# EAGLE design smartstand-usb-dac-i2s-rev-a (EAGLE 7.3.0)

## Sheet 1 of 4
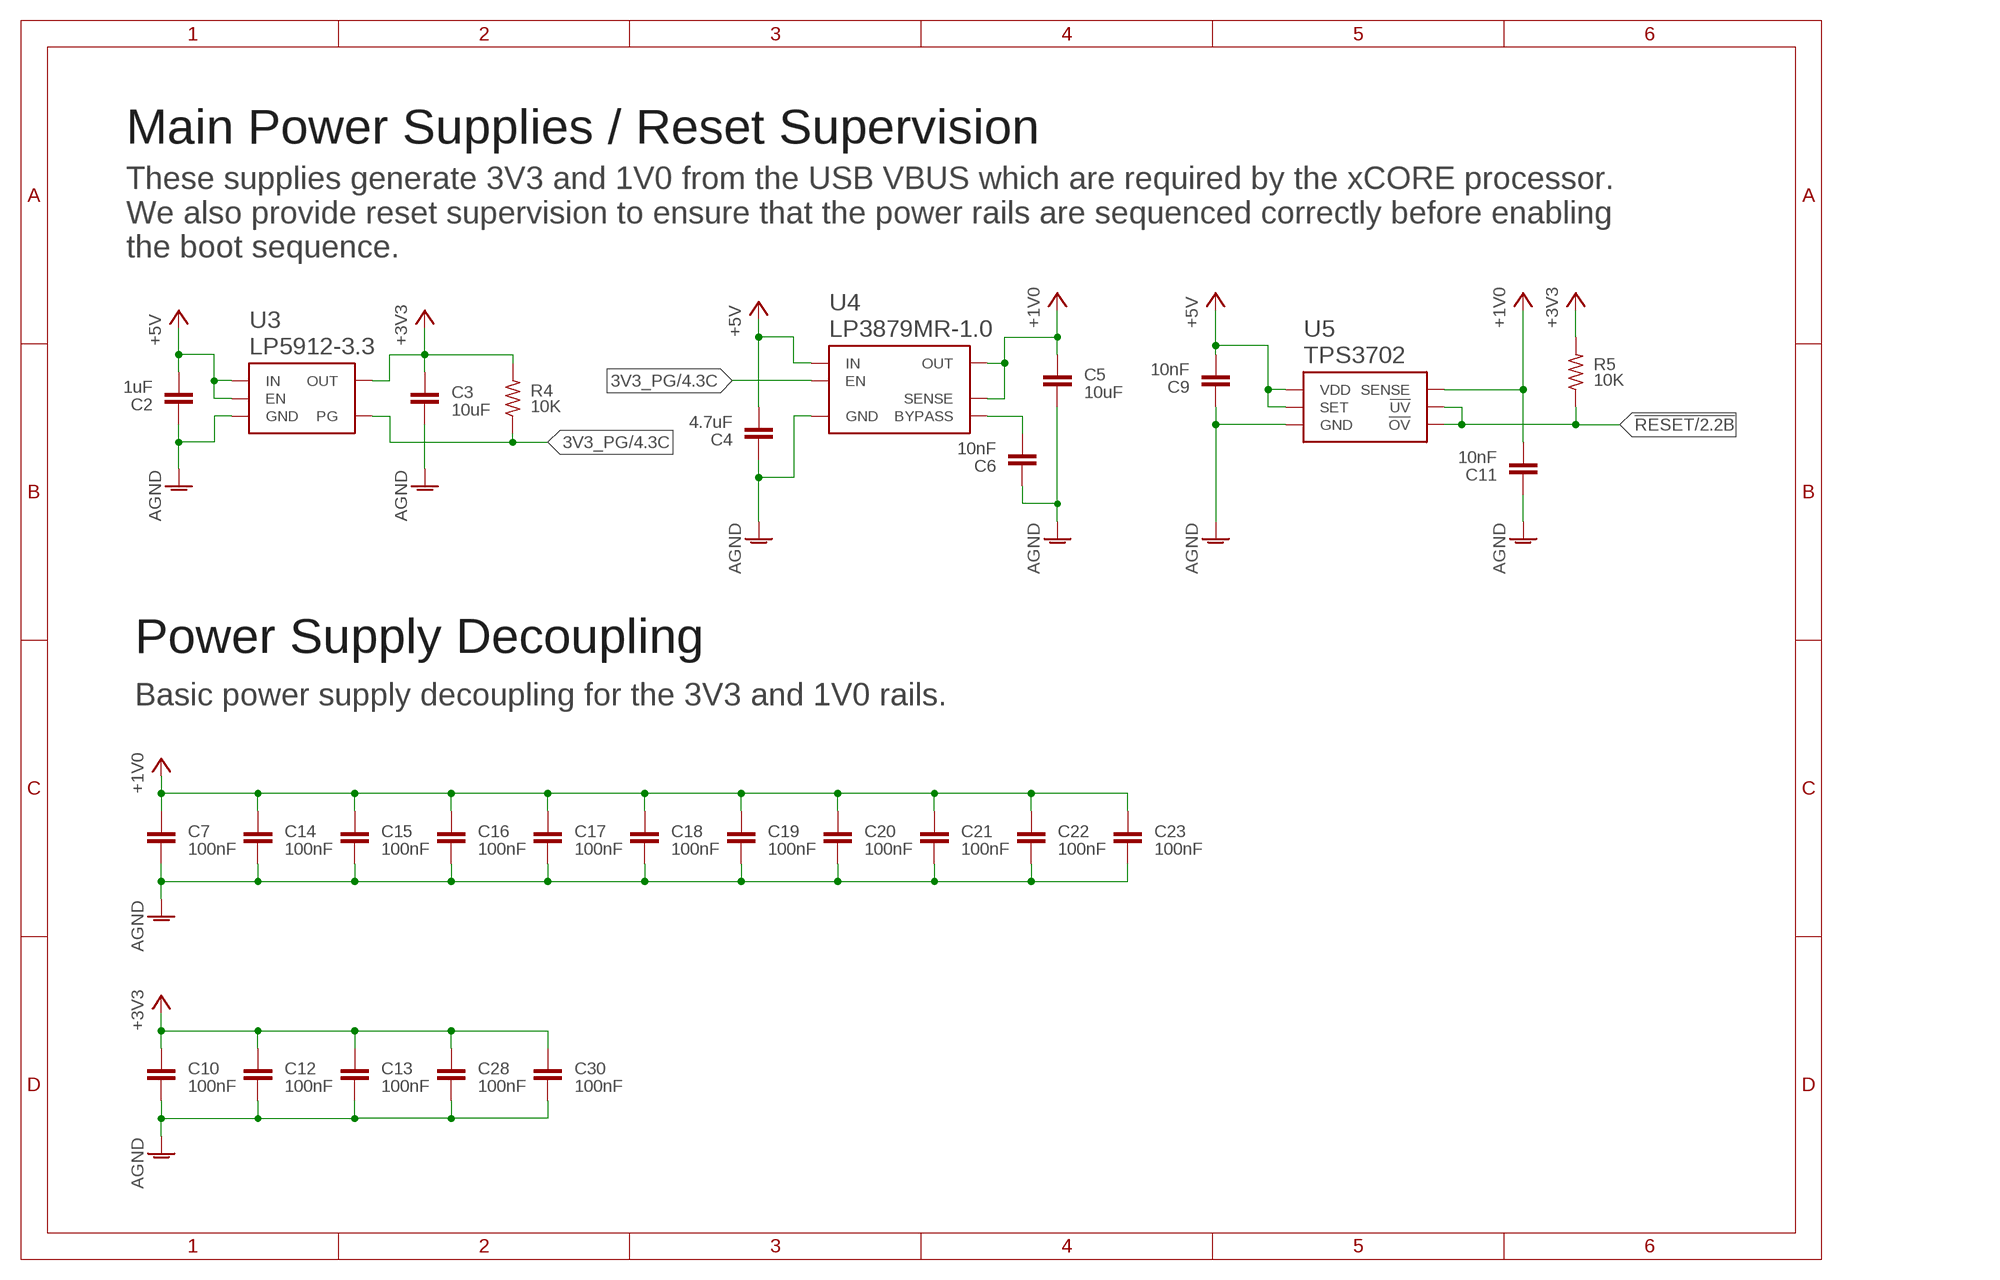
[diagram p0: schematic, sheet 1]

### Parts
C2  1uF  C-EUC0603  [C0603]
C3  10uF  C-EUC0603  [C0603]
C4  4.7uF  C-EUC0603  [C0603]
C5  10uF  C-EUC0603  [C0603]
C6  10nF  C-EUC0402  [C0402]
C7  100nF  C-EUC0402  [C0402]
C9  10nF  C-EUC0402  [C0402]
C10  100nF  C-EUC0402  [C0402]
C11  10nF  C-EUC0402  [C0402]
C12  100nF  C-EUC0402  [C0402]
C13  100nF  C-EUC0402  [C0402]
C14  100nF  C-EUC0402  [C0402]
C15  100nF  C-EUC0402  [C0402]
C16  100nF  C-EUC0402  [C0402]
C17  100nF  C-EUC0402  [C0402]
C18  100nF  C-EUC0402  [C0402]
C19  100nF  C-EUC0402  [C0402]
C20  100nF  C-EUC0402  [C0402]
C21  100nF  C-EUC0402  [C0402]
C22  100nF  C-EUC0402  [C0402]
C23  100nF  C-EUC0402  [C0402]
C28  100nF  C-EUC0402  [C0402]
C30  100nF  C-EUC0402  [C0402]
R4  10K  R-US-VERTICALR0402  [R0402]
R5  10K  R-US-VERTICALR0402  [R0402]
U3  LP5912-3.3  LP5912-3.3DRV  [P-PWSON-N6]
U4  LP3879MR-1.0  [PSOP-8-POWERPAD-DDA]
U5  TPS3702  TPS3702CX10DDC  [R-PDSO-G6]

### Nets
3V3_PG: R4.1 U3.P$3(PG) U4.8(EN) ; also sheet 4
!RESET: R5.1 U5.1(!UV) U5.6(!OV) ; also sheet 2,3
+1V0: C5.1 C7.1 C11.2 C14.1 C15.1 C16.1 C17.1 C18.1 C19.1 C20.1 C21.1 C22.1 C23.1 U4.5(OUT) U4.6(SENSE) U5.3(SENSE) ; also sheet 2,4
+3V3: C3.1 C10.1 C12.1 C13.1 C28.1 C30.1 R4.2 R5.2 U3.P$1(OUT) ; also sheet 2,3,4
+5V: C2.2 C4.2 C9.2 U3.P$4(EN) U3.P$6(IN) U4.4(IN) U5.4(SET) U5.5(VDD) ; also sheet 3,4
AGND: C2.1 C3.2 C4.1 C5.2 C6.1 C7.2 C9.1 C10.2 C11.1 C12.2 C13.2 C14.2 C15.2 C16.2 C17.2 C18.2 C19.2 C20.2 C21.2 C22.2 C23.2 C28.2 C30.2 U3.P$5(GND) U3.P$8(GND) U3.P$9(GND) U3.P$EP(GND) U4.3(GND) U4.EP(GND) U4.P$1(GND) U4.P$2(GND) U4.P$3(GND) U4.P$4(GND) U4.P$5(GND) U4.P$6(GND) U5.2(GND) ; also sheet 2,3,4
N$11: C6.2 U4.1(BYPASS)

### Notes on the sheet
- Main Power Supplies / Reset Supervision
- These supplies generate 3V3 and 1V0 from the USB VBUS which are required by the xCORE processor.
  We also provide reset supervision to ensure that the power rails are sequenced correctly before enabling
  the boot sequence.
- Power Supply Decoupling
- Basic power supply decoupling for the 3V3 and 1V0 rails.

## Sheet 2 of 4
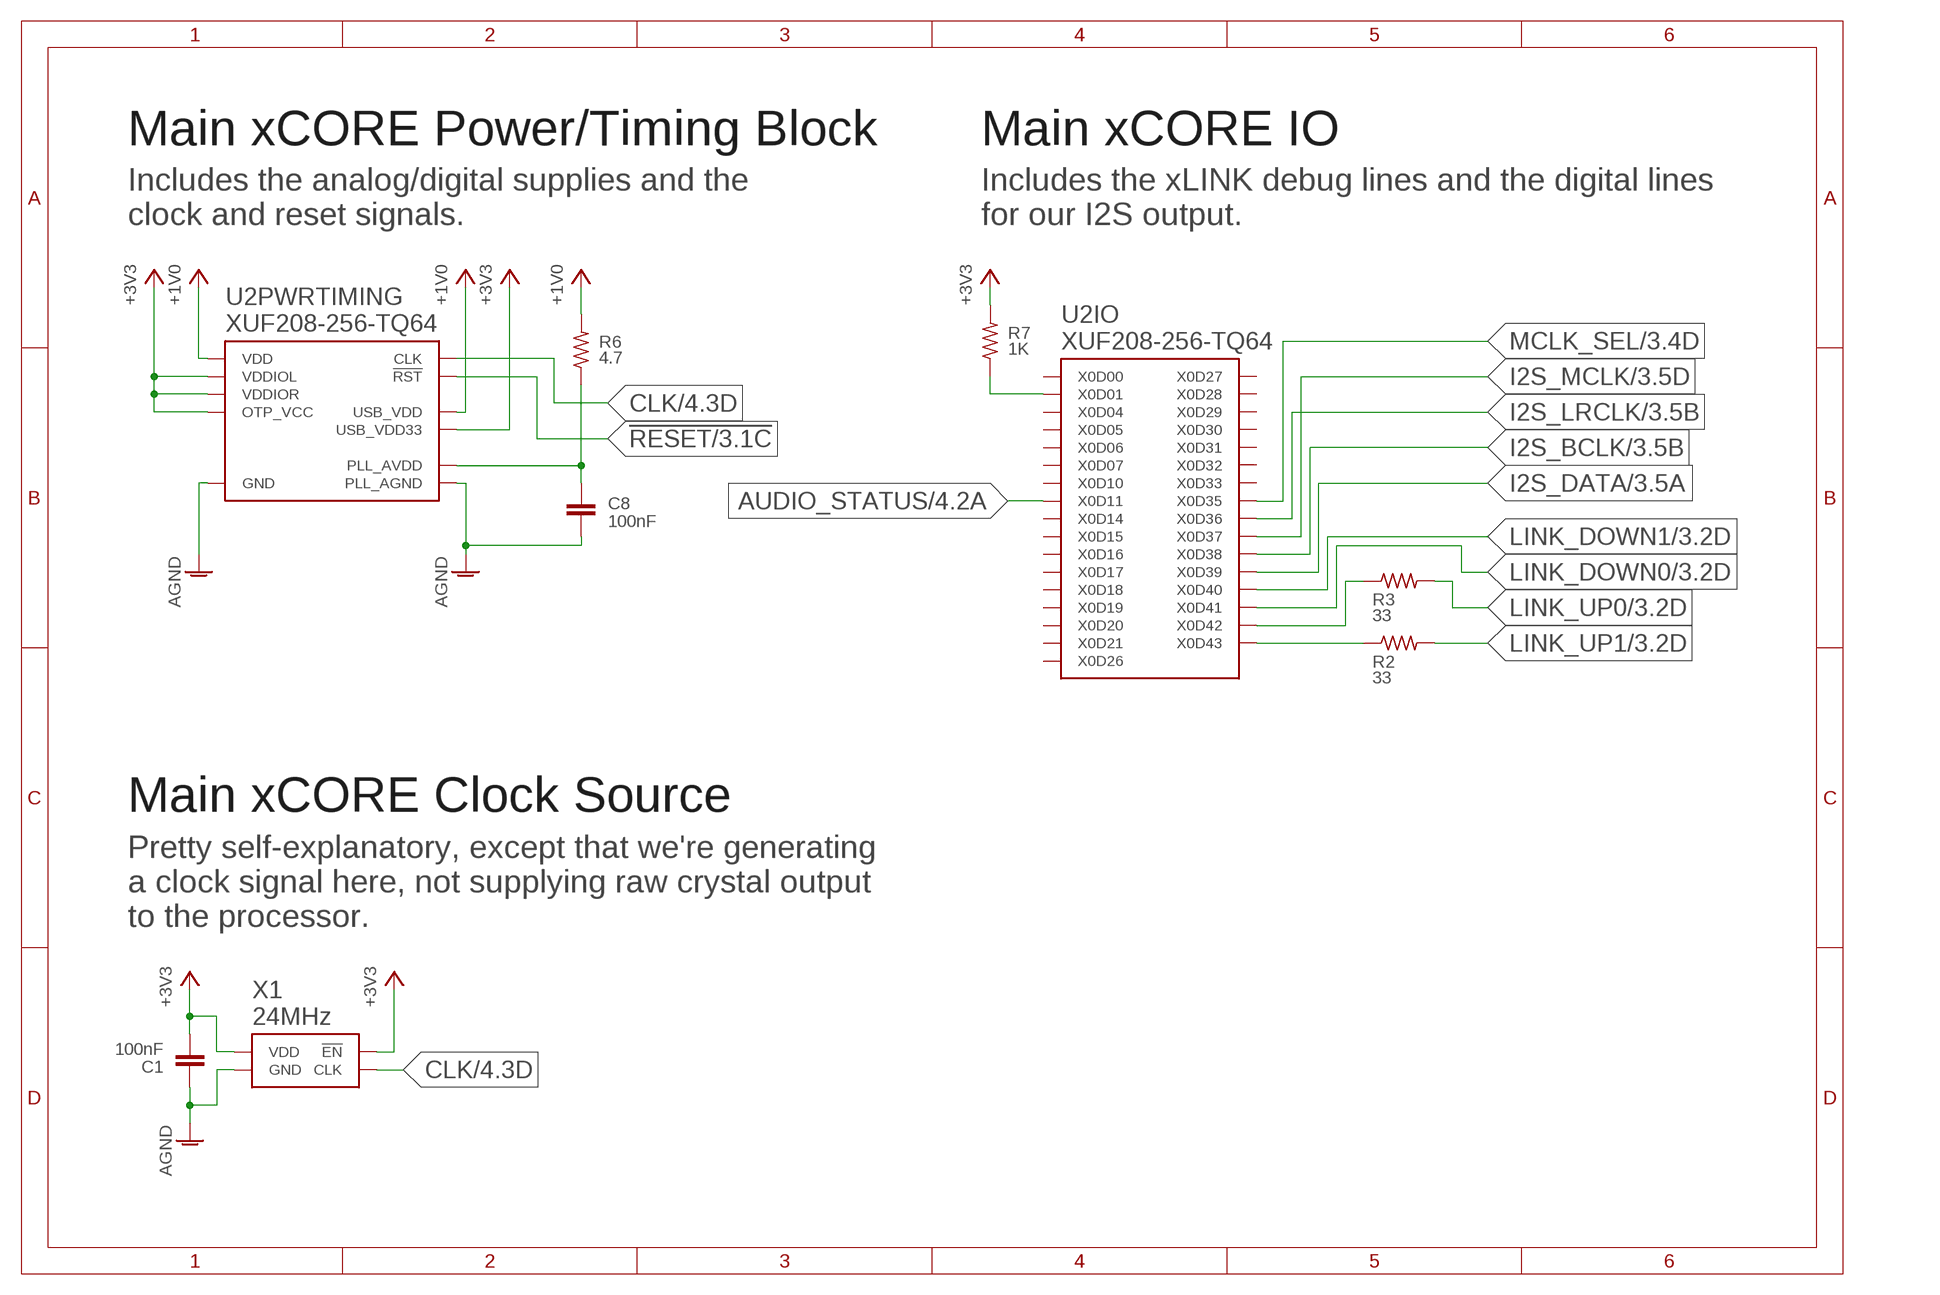
[diagram p1: schematic, sheet 2]

### Parts
C1  100nF  C-EUC0402  [C0402]
C8  100nF  C-EUC0402  [C0402]
R2  33  R-US_R0402  [R0402]
R3  33  R-US_R0402  [R0402]
R6  4.7  R-US-VERTICALR0402  [R0402]
R7  1K  R-US-VERTICALR0402  [R0402]
U2  XUF208-256-TQ64  [TQFP-64-EXPOSED-PAD]
X1  24MHz  KC2520C  [KC2520C]

### Nets
!RESET: U2.P$57(PWRTIMING:!RST) ; also sheet 1,3
+1V0: R6.2 U2.P$9(PWRTIMING:VDD) U2.P$10(PWRTIMING:VDD) U2.P$20(PWRTIMING:VDD) U2.P$27(PWRTIMING:USB_VDD) U2.P$31(PWRTIMING:VDD) U2.P$39(PWRTIMING:VDD) U2.P$40(PWRTIMING:VDD) U2.P$41(PWRTIMING:VDD) U2.P$52(PWRTIMING:VDD) U2.P$56(PWRTIMING:VDD) U2.P$59(PWRTIMING:VDD) ; also sheet 1,4
+3V3: C1.2 R7.2 U2.P$3(PWRTIMING:VDDIOL) U2.P$13(PWRTIMING:VDDIOL) U2.P$22(PWRTIMING:USB_VDD33) U2.P$34(PWRTIMING:VDDIOR) U2.P$44(PWRTIMING:VDDIOR) U2.P$55(PWRTIMING:OTP_VCC) X1.P$1(!EN) X1.P$4(VDD) ; also sheet 1,3,4
AGND: C1.1 C8.2 U2.P$54(PWRTIMING:PLL_AGND) U2.P$65(PWRTIMING:GND) U2.P$66(PWRTIMING:GND) U2.P$67(PWRTIMING:GND) U2.P$68(PWRTIMING:GND) U2.P$69(PWRTIMING:GND) U2.P$70(PWRTIMING:GND) U2.P$71(PWRTIMING:GND) U2.P$72(PWRTIMING:GND) U2.P$73(PWRTIMING:GND) U2.P$74(PWRTIMING:GND) X1.P$2(GND) ; also sheet 1,3,4
AUDIO_STATUS: U2.P$16(IO:X0D11) ; also sheet 4
CLK: U2.P$58(PWRTIMING:CLK) X1.P$3(CLK) ; also sheet 4
I2S_BCLK: U2.P$2(IO:X0D38) ; also sheet 3
I2S_DATA: U2.P$4(IO:X0D39) ; also sheet 3
I2S_LRCLK: U2.P$1(IO:X0D36) ; also sheet 3
I2S_MCLK: U2.P$64(IO:X0D37) ; also sheet 3
LINK_DOWN0: U2.P$6(IO:X0D41) ; also sheet 3
LINK_DOWN1: U2.P$5(IO:X0D40) ; also sheet 3
LINK_UP0: R3.2 ; also sheet 3
LINK_UP1: R2.2 ; also sheet 3
MCLK_SEL: U2.P$42(IO:X0D35) ; also sheet 3
N$6: C8.1 R6.1 U2.P$53(PWRTIMING:PLL_AVDD)
N$8: R3.1 U2.P$7(IO:X0D42)
N$9: R2.1 U2.P$8(IO:X0D43)
N$10: R7.1 U2.P$11(IO:X0D01)
Unconnected: U2.P$12(IO:X0D10) U2.P$14(IO:X0D00) U2.P$15(IO:X0D04) U2.P$17(IO:X0D05) U2.P$18(IO:X0D06) U2.P$19(IO:X0D07) U2.P$28(IO:X0D14) U2.P$29(IO:X0D15) U2.P$30(IO:X0D20) U2.P$32(IO:X0D21) U2.P$35(IO:X0D16) U2.P$36(IO:X0D17) U2.P$37(IO:X0D18) U2.P$38(IO:X0D19) U2.P$43(IO:X0D26) U2.P$45(IO:X0D27) U2.P$46(IO:X0D32) U2.P$47(IO:X0D28) U2.P$48(IO:X0D33) U2.P$49(IO:X0D29) U2.P$50(IO:X0D30) U2.P$51(IO:X0D31)

### Notes on the sheet
- Main xCORE Power/Timing Block | Main xCORE IO
- Includes the analog/digital supplies and the
  clock and reset signals.
- Includes the xLINK debug lines and the digital lines
  for our I2S output.
- Main xCORE Clock Source
- Pretty self-explanatory, except that we're generating
  a clock signal here, not supplying raw crystal output
  to the processor.

## Sheet 3 of 4
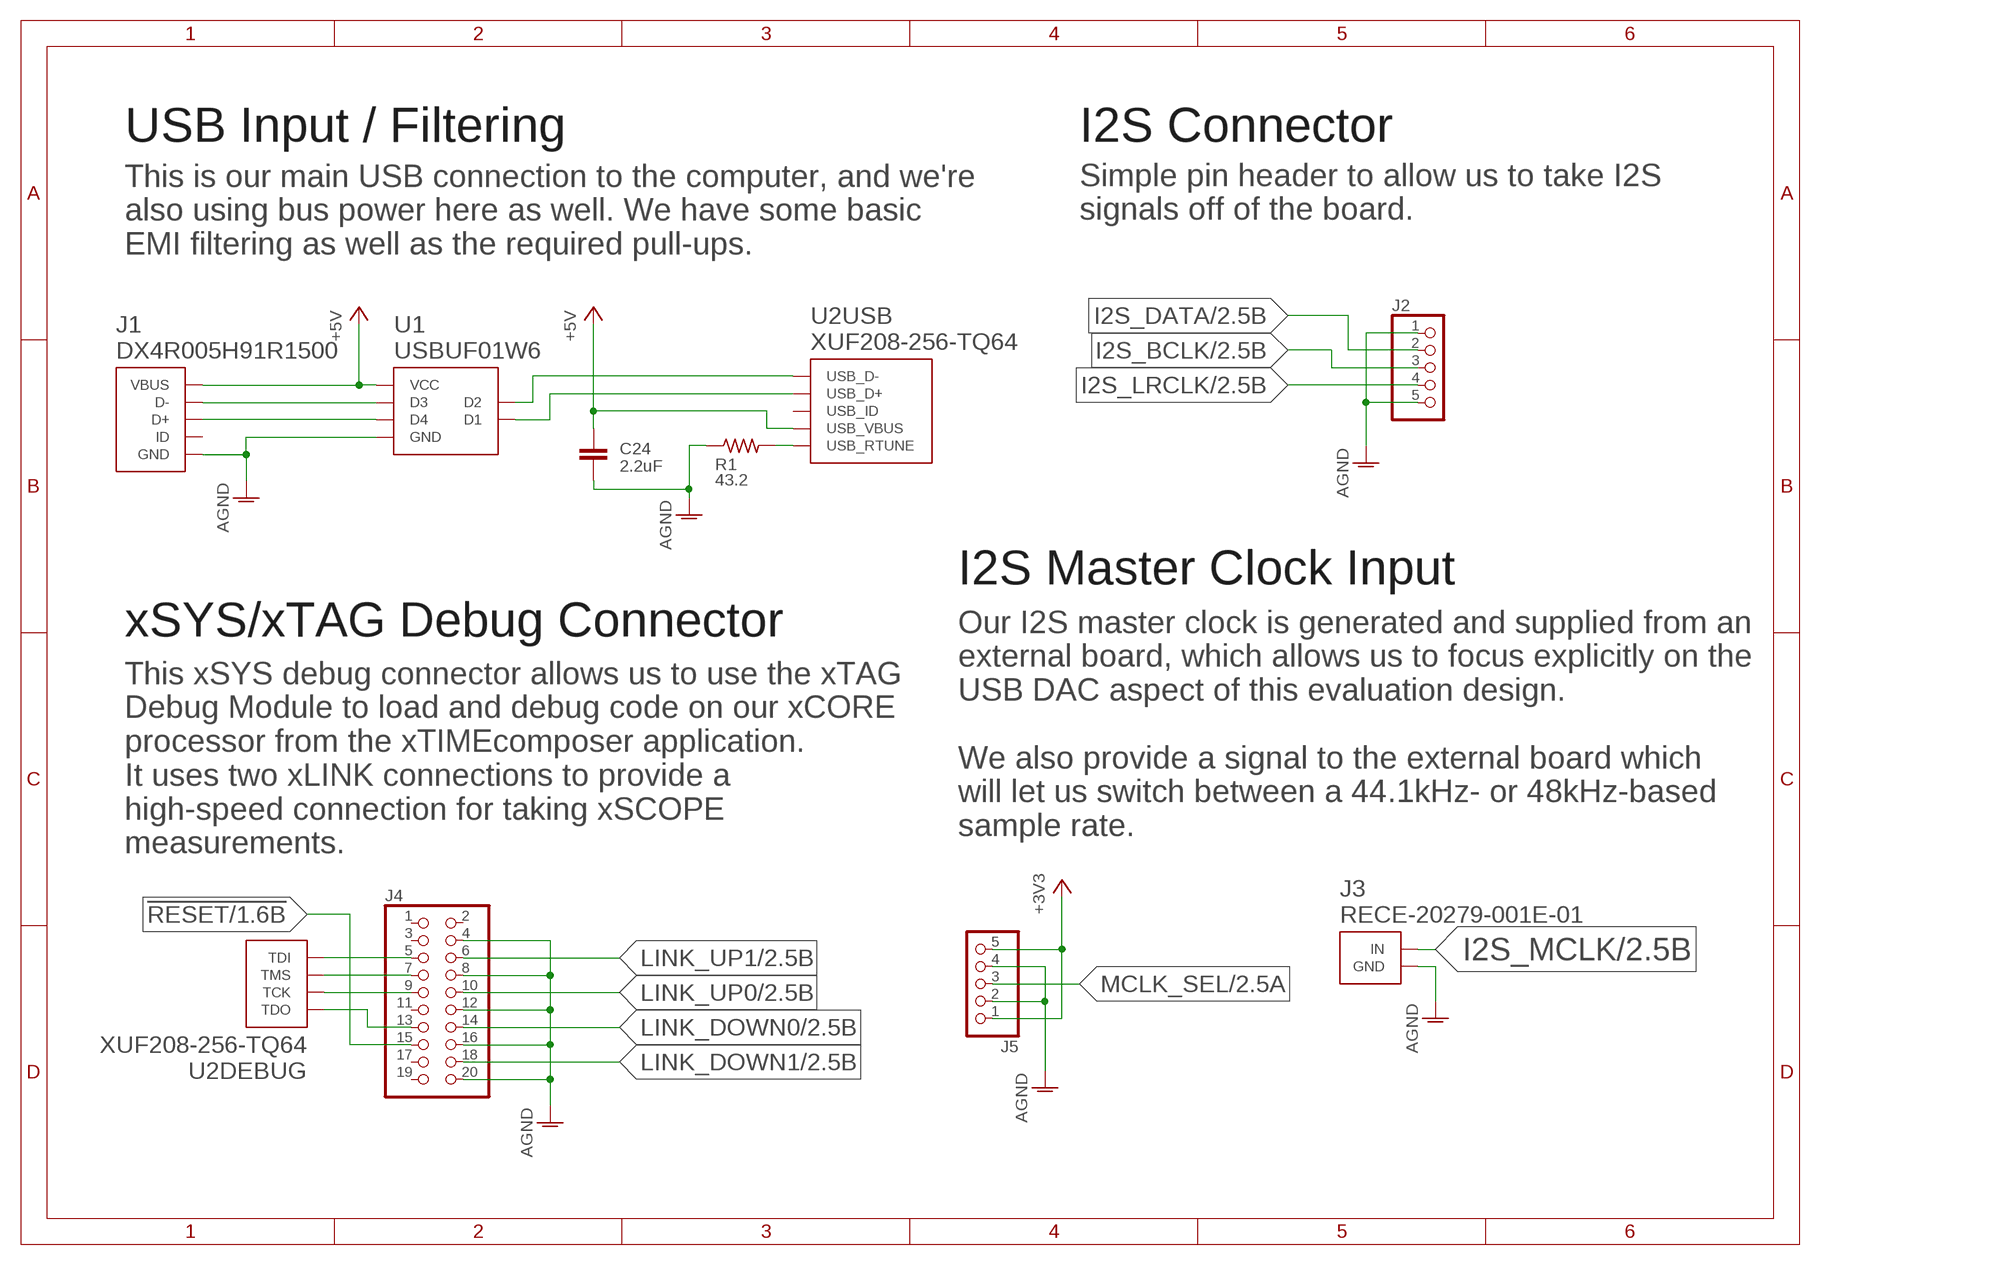
[diagram p2: schematic, sheet 3]

### Parts
C24  2.2uF  C-EUC0603  [C0603]
J1  DX4R005H91R1500  [DX4R005H91R1500]
J2  PINHD-1X5  [1X05]
J3  RECE-20279-001E-01  [IPEX-MHF]
J4  PINHD-2X10  [2X10]
J5  PINHD-1X5  [1X05]
R1  43.2  R-US_R0402  [R0402]
U1  USBUF01W6  USBUF  [SOT323-6L]

### Nets
!RESET: J4.15 ; also sheet 1,2
+3V3: J5.1 J5.5 ; also sheet 1,2,4
+5V: C24.1 J1.P$1(VBUS) U1.P$5(VCC) U2.P$23(USB:USB_VBUS) ; also sheet 1,4
AGND: C24.2 J1.P$5(GND) J2.1 J2.5 J3.P$1(GND) J3.P$2(GND) J4.4 J4.8 J4.12 J4.16 J4.20 J5.2 J5.4 R1.1 U1.P$2(GND) ; also sheet 1,2,4
CLEAN_USB_D_N [USB]: U1.P$3(D2) U2.P$26(USB:USB_D-)
CLEAN_USB_D_P [USB]: U1.P$1(D1) U2.P$25(USB:USB_D+)
I2S_BCLK: J2.3 ; also sheet 2
I2S_DATA: J2.2 ; also sheet 2
I2S_LRCLK: J2.4 ; also sheet 2
I2S_MCLK: J3.P$3(IN) ; also sheet 2
LINK_DOWN0: J4.14 ; also sheet 2
LINK_DOWN1: J4.18 ; also sheet 2
LINK_UP0: J4.10 ; also sheet 2
LINK_UP1: J4.6 ; also sheet 2
MCLK_SEL: J5.3 ; also sheet 2
N$1: R1.2 U2.P$24(USB:USB_RTUNE)
N$2: J4.7 U2.P$60(DEBUG:TMS)
N$3: J4.9 U2.P$61(DEBUG:TCK)
N$4: J4.5 U2.P$62(DEBUG:TDI)
N$5: J4.13 U2.P$63(DEBUG:TDO)
RAW_USB_D_N [USB]: J1.P$2(D-) U1.P$4(D3)
RAW_USB_D_P [USB]: J1.P$3(D+) U1.P$6(D4)
Unconnected: J1.P$4(ID) J4.1 J4.2 J4.3 J4.11 J4.17 J4.19 U2.P$21(USB:USB_ID)

### Notes on the sheet
- USB Input / Filtering | I2S Connector
- Simple pin header to allow us to take I2S
  signals off of the board.
- This is our main USB connection to the computer, and we're
  also using bus power here as well. We have some basic
  EMI filtering as well as the required pull-ups.
- I2S Master Clock Input
- xSYS/xTAG Debug Connector
- Our I2S master clock is generated and supplied from an
  external board, which allows us to focus explicitly on the
  USB DAC aspect of this evaluation design.
  
  We also provide a signal to the external board which
  will let us switch between a 44.1kHz- or 48kHz-based
  sample rate.
- This xSYS debug connector allows us to use the xTAG
  Debug Module to load and debug code on our xCORE
  processor from the xTIMEcomposer application.
  It uses two xLINK connections to provide a
  high-speed connection for taking xSCOPE
  measurements.

## Sheet 4 of 4
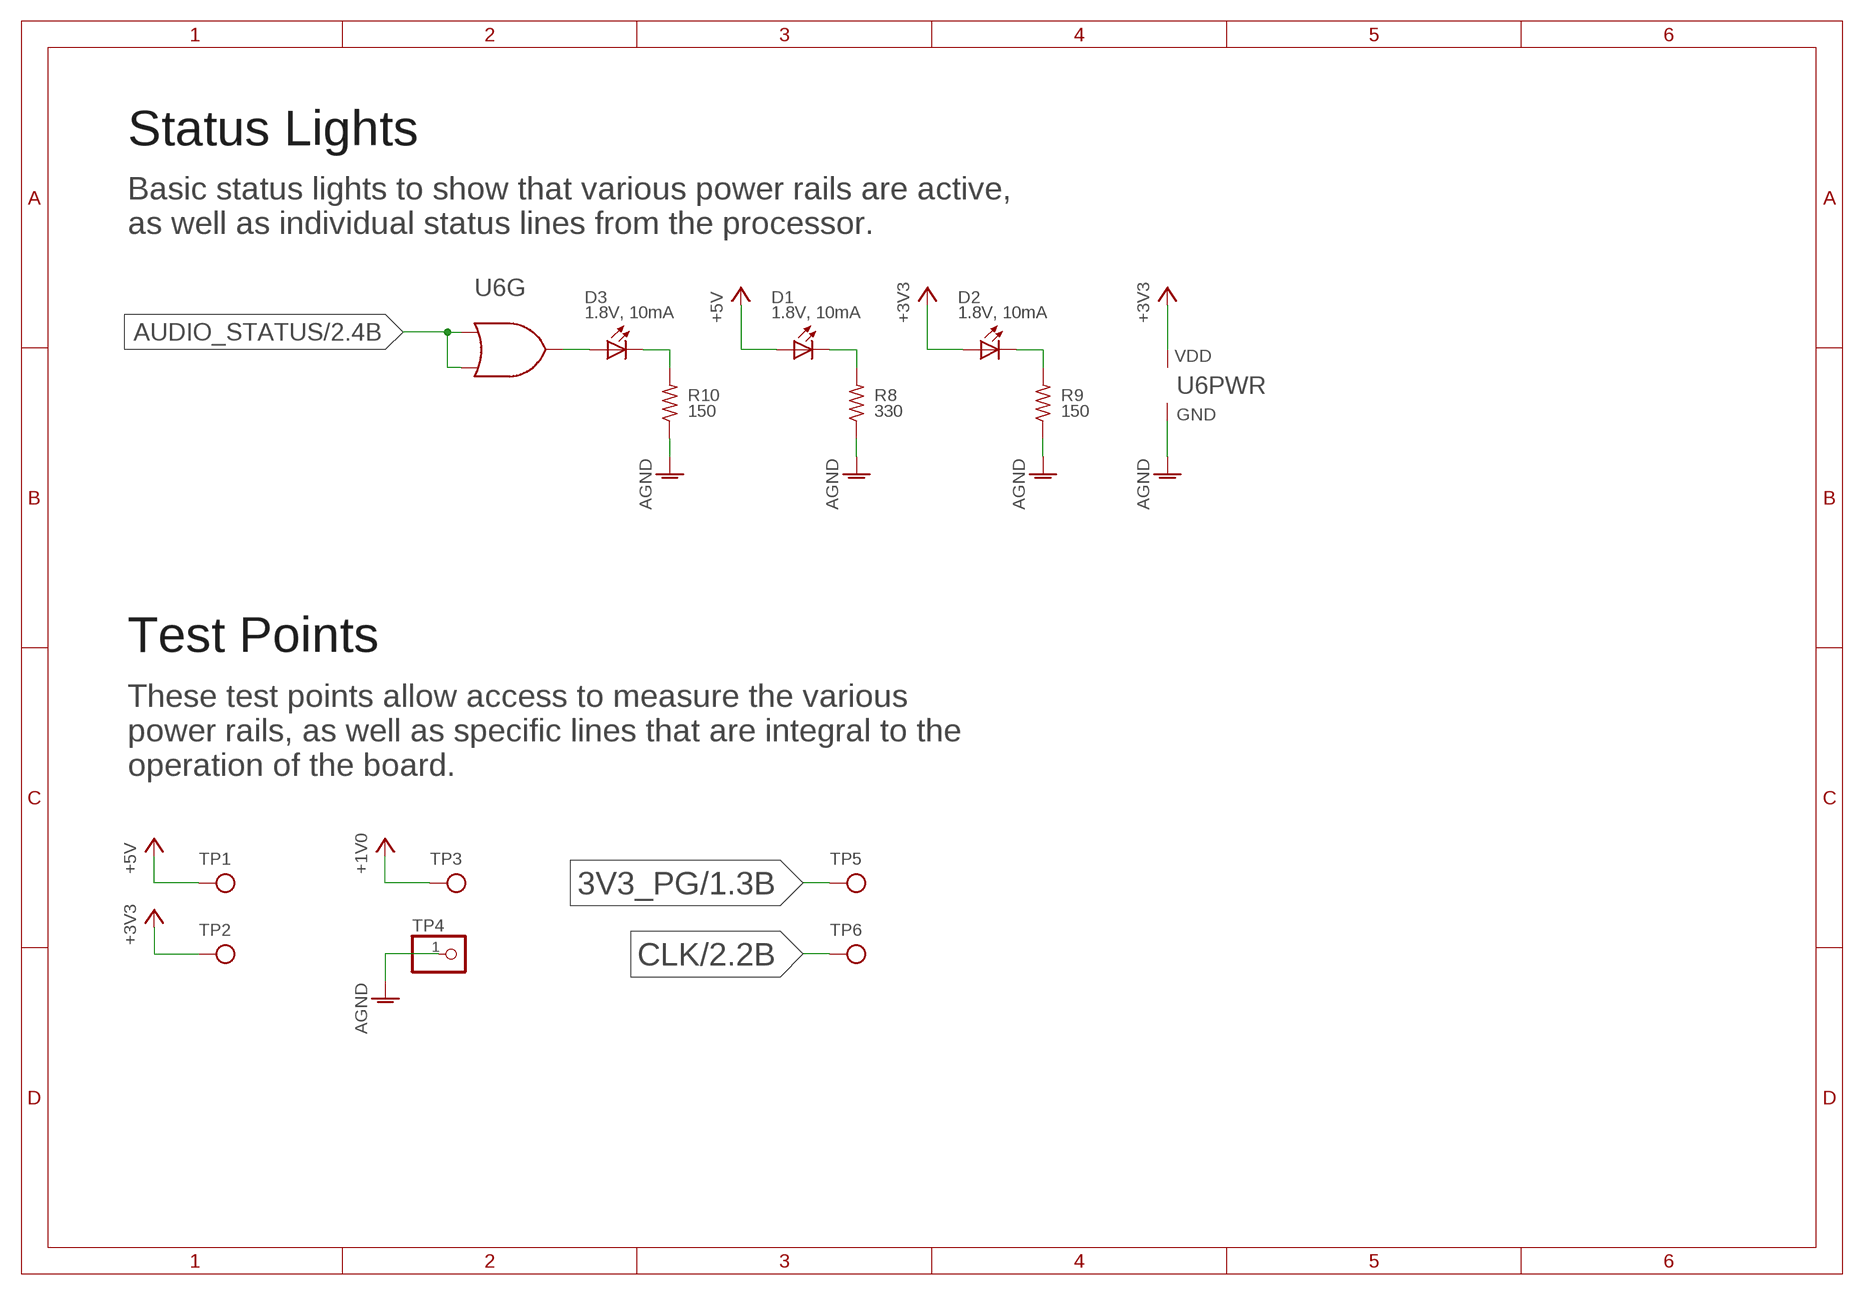
[diagram p3: schematic, sheet 4]

### Parts
D1  1.8V, 10mA  DIALIGHT-598-MICROSMD-0603  [DIALIGHT-0603]
D2  1.8V, 10mA  DIALIGHT-598-MICROSMD-0603  [DIALIGHT-0603]
D3  1.8V, 10mA  DIALIGHT-598-MICROSMD-0603  [DIALIGHT-0603]
R8  330  R-US-VERTICALR0402  [R0402]
R9  150  R-US-VERTICALR0402  [R0402]
R10  150  R-US-VERTICALR0402  [R0402]
TP1  TESTPOINT-1.5MM  [TESTPOINT-1.5]
TP2  TESTPOINT-1.5MM  [TESTPOINT-1.5]
TP3  TESTPOINT-1.5MM  [TESTPOINT-1.5]
TP4  PINHD-1X1  [1X01]
TP5  TESTPOINT-1.5MM  [TESTPOINT-1.5]
TP6  TESTPOINT-1.5MM  [TESTPOINT-1.5]
U6  SN74LVC1G32DRL  [R-PDSO-N5]

### Nets
3V3_PG: TP5.P$1 ; also sheet 1
+1V0: TP3.P$1 ; also sheet 1,2
+3V3: D2.1(A) TP2.P$1 U6.5(PWR:VDD) ; also sheet 1,2,3
+5V: D1.1(A) TP1.P$1 ; also sheet 1,3
AGND: R8.1 R9.1 R10.1 TP4.1 U6.3(PWR:GND) ; also sheet 1,2,3
AUDIO_STATUS: U6.1(G:A) U6.2(G:B) ; also sheet 2
CLK: TP6.P$1 ; also sheet 2
N$7: D1.2(C) R8.2
N$12: D2.2(C) R9.2
N$13: D3.1(A) U6.4(G:Q)
N$14: D3.2(C) R10.2

### Notes on the sheet
- Status Lights
- Basic status lights to show that various power rails are active,
  as well as individual status lines from the processor.
- Test Points
- These test points allow access to measure the various
  power rails, as well as specific lines that are integral to the
  operation of the board.

## Library data of the parts
C1 C7 C8 C10 C12-C23 C28 C30 = passives:C-EU: CAPACITOR, European symbol; PN: GRM155R71C104KA88D
C2 = passives:C-EU: CAPACITOR, European symbol; PN: GRM188R61C105KA93D
C3 C5 = passives:C-EU: CAPACITOR, European symbol; PN: GRM188R60J106ME47D
C4 = passives:C-EU: CAPACITOR, European symbol; PN: GRM188R61A475KE15D
C6 C9 C11 = passives:C-EU: CAPACITOR, European symbol; PN: GRM15XR71C103KA86D
C24 = passives:C-EU: CAPACITOR, European symbol; PN: GRM188R61C225KE15D
D1-D3 = dialight:DIALIGHT-598-MICROSMD; PN: 598-8070-107F
J1 = jae:DX4R005H91R1500; PN: DX4R005H91R1500
J2 J5 = pin-headers:PINHD-1X5: PIN HEADER; PN: 90120-0125
J3 = taoglas:RECE-20279-001E-01; PN: RECE-20279-001E-01
J4 = pin-headers:PINHD-2X10: PIN HEADER; PN: N2520-5002RB
R1 = passives:R-US_: RESISTOR, American symbol; PN: RK73B1ETTP430J
R2 R3 = passives:R-US_: RESISTOR, American symbol; PN: RK73B1ETTP330J
R4 R5 = passives:R-US-VERTICAL; PN: RK73B1ETTP103J
R6 = passives:R-US-VERTICAL; PN: SG73P1ETTP4R7J
R7 = passives:R-US-VERTICAL; PN: RK73B1ETTP102J
R8 = passives:R-US-VERTICAL; PN: ERJ-PA2J331X
R9 R10 = passives:R-US-VERTICAL; PN: SG73P1ETTP151J
TP1-TP3 TP5 TP6 = test:TESTPOINT: Simple exposed copper testpoint pad.
TP4 = pin-headers:PINHD-1X1: PIN HEADER; PN: 90120-0121
U1 = st-microelectronics:USBUF: EMI filter and line termination for USB upstream ports The USB specification requires upstream ports to be terminated with pull-up resistors from the D+ and D- lines to Vbus. On the implementation of USB systems, the radiated and conducted EMI should be kept within the required levels as stated by the FCC regulations. In addition to the requirements of termination and EMC compatibility, the computing devices are required to be tested for ESD susceptibility. The USBUF provides the recommended line termination while implementing a low pass filter to limit EMI levels and providing ESD protection which exceeds IEC 61000-4-2 level 4 standard. The device is packaged in a SOT323-6L which is the smallest available lead frame package (50% smaller than the standard SOT23).; PN: USBUF01W6
U2 = xmos:XUF208-256-TQ64: Multicore Microcontroller with Advanced Multi-Core RISC Architecture https://www.xmos.com/download/private/XUF208-256-TQ64-Datasheet%281.10%29.pdf; PN: XUF208-256-TQ64-C10
U3 = texas-instruments:LP5912: 500-mA Low-Noise, Low-IQ LDO; PN: LP5912-3.3DRVR
U4 = texas-instruments:LP3879: LP3879 - Micropower 800mA Low Noise "Ceramic Stable" Voltage Regulator for Low Voltage Applications The LP3879 is a 800 mA fixed-output voltage regulator designed to provide high performance and low noise in applications requiring output voltages between 1.0V and 1.2V. Using an optimized VIP (Vertically Integrated PNP) process, the LP3879 delivers superior performance: Ground Pin Current: Typically 5.5 mA @ 800 mA load, and 200 µA @ 100 µA load. Low Power Shutdown: The LP3879 draws less than 10 μA quiescent current when shutdown pin is pulled low. Precision Output: Ensured output voltage accuracy is 1% at room temperature. Low Noise: Broadband output noise is only 18 μV (typical) with 10 nF bypass capacitor.; PN: LP3879MR-1.0/NOPB
U5 = texas-instruments:TPS3702: High-Accuracy, Overvoltage and Undervoltage Monitor; PN: TPS3702CX10DDC
U6 = texas-instruments:SN74LVC1G32: Single 2-Input Positive-OR Gate This single 2-input positive-OR gate is designed for 1.65-V to 5.5-V VCC operation. The SN74LVC1G32 performs the Boolean function Y = A + B in positive logic. NanoStar™ and NanoFree™ package technology is a major breakthrough in IC packaging concepts, using the die as the package. This device is fully specified for partial-power-down applications using Ioff. The Ioff circuitry disables the outputs, preventing damaging current backflow through the device when it is powered down.; PN: SN74LVC1G32DRLR
X1 = crystals:KC2520C: High Stability Clock Oscillators, CMOS, 2.5V/3.3V Compatible, 2.5×2.0mm; PN: KC2520C24.0000C2LE00

## Net classes
0 default: width 0.152 mm, drill 0.254 mm
1 USB: width 0.279 mm, drill 0.254 mm, clearance 0.203 mm

## Board
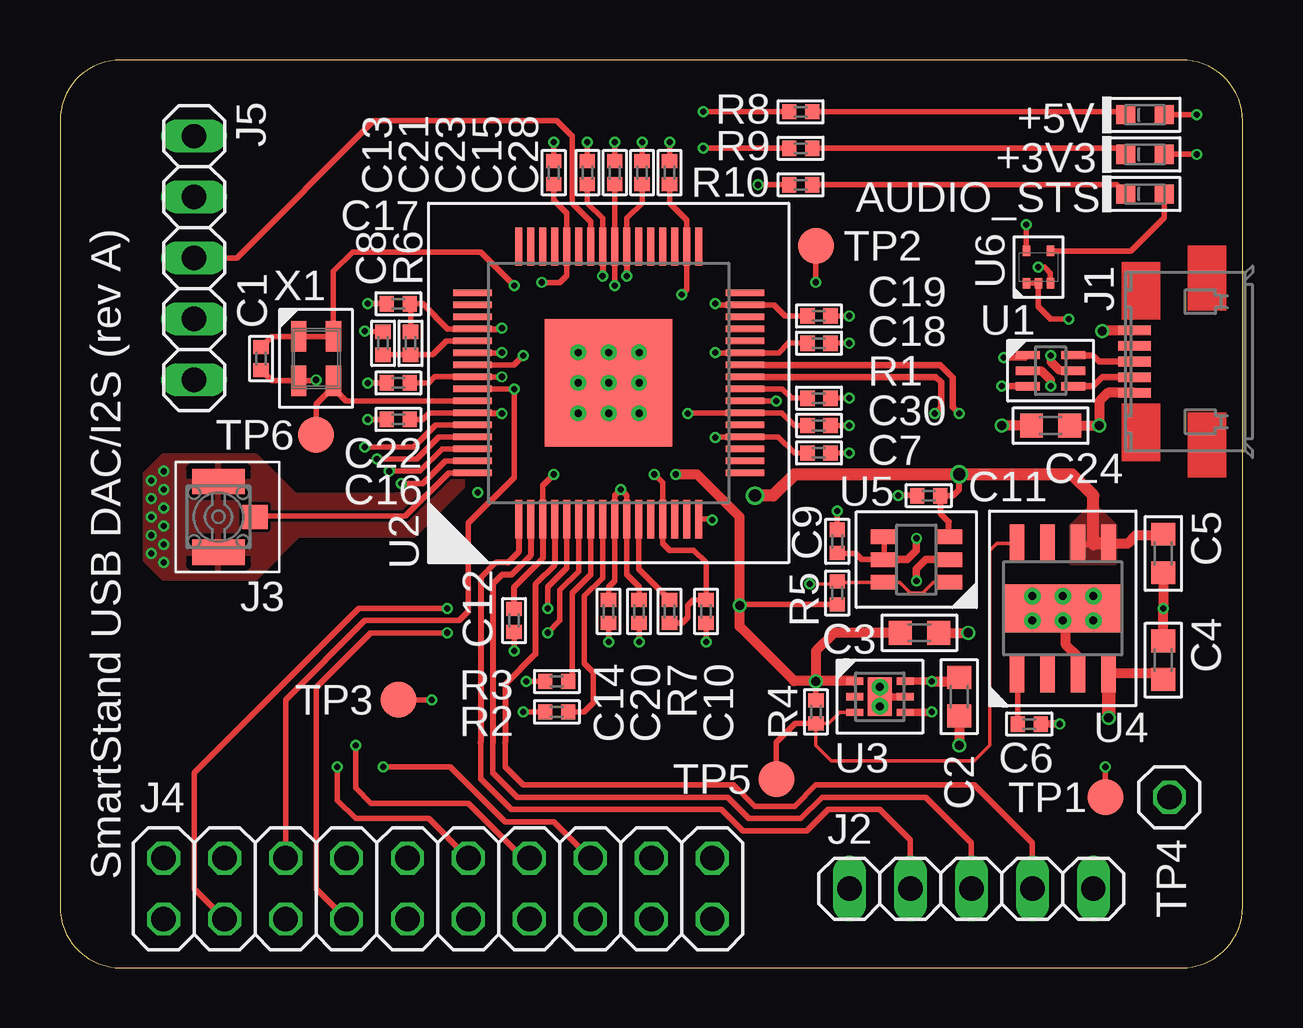
[diagram p4: board, top side]
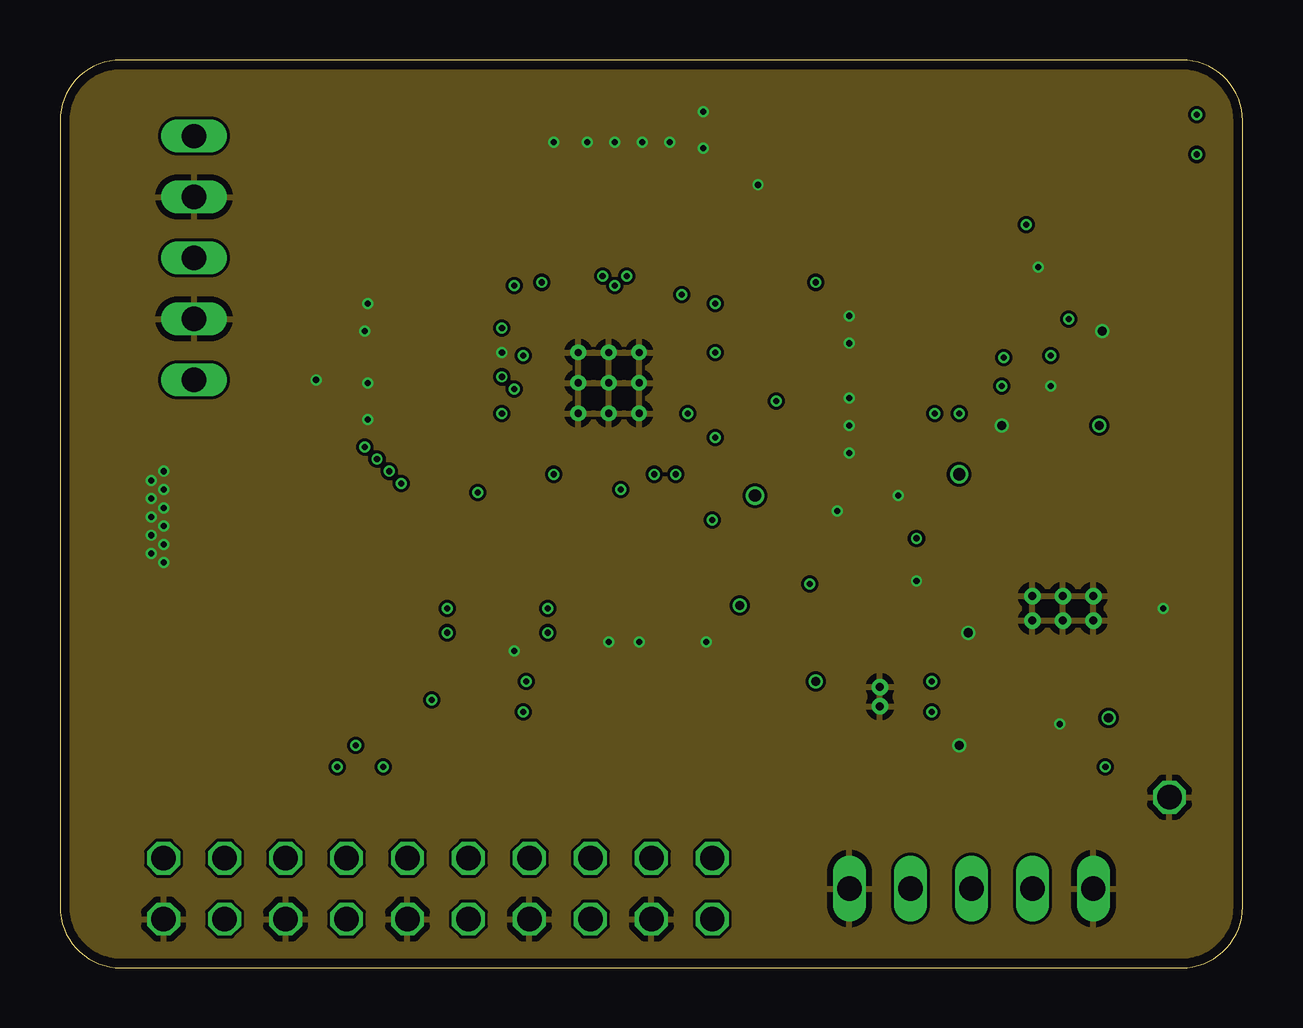
[diagram p5: board, inner layer Route2]
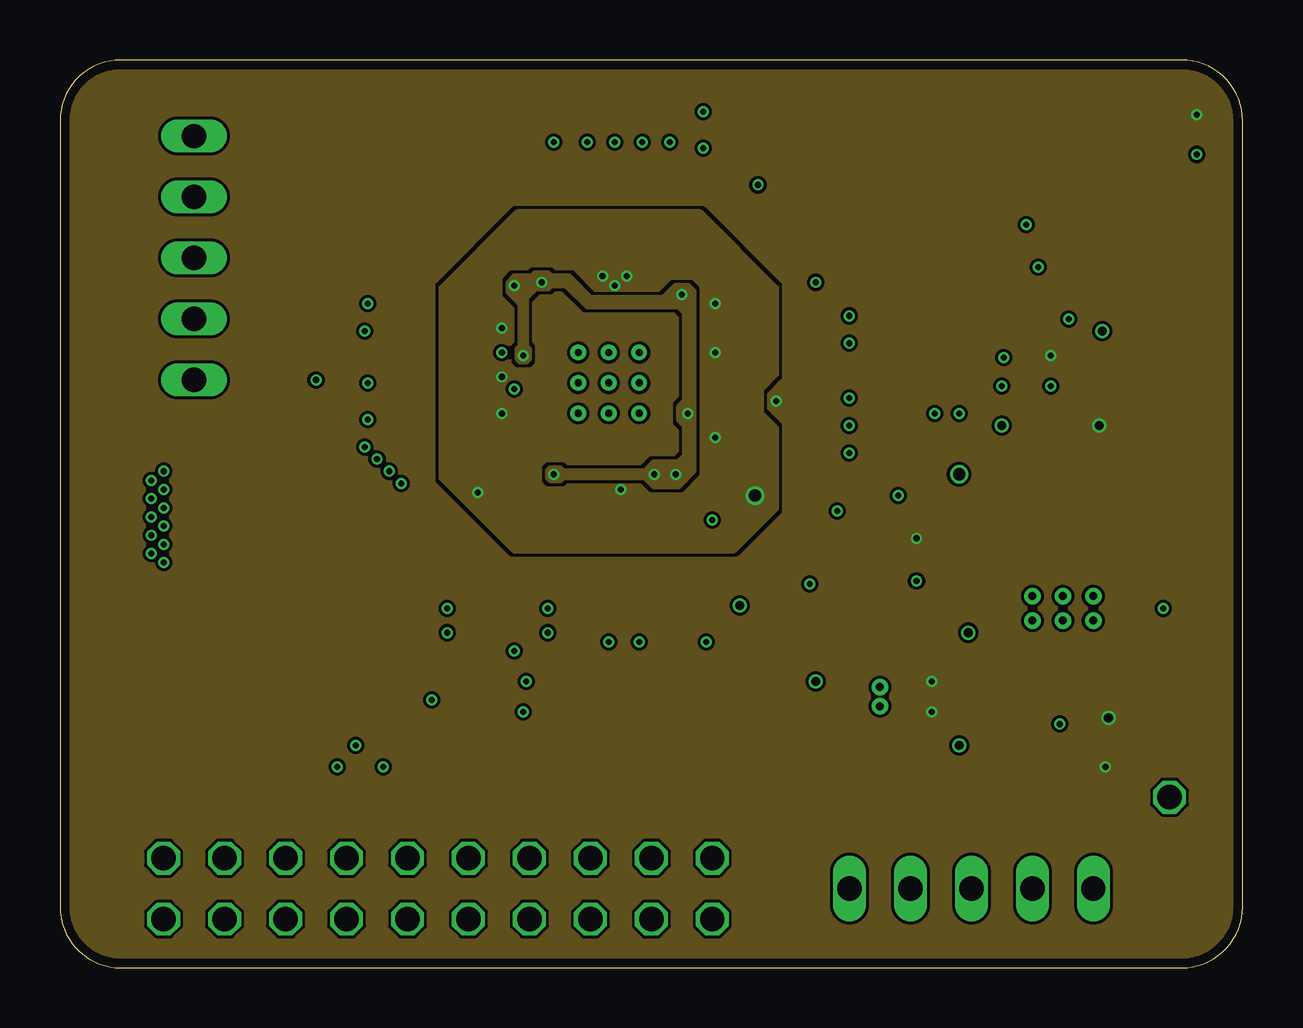
[diagram p6: board, inner layer Route15]
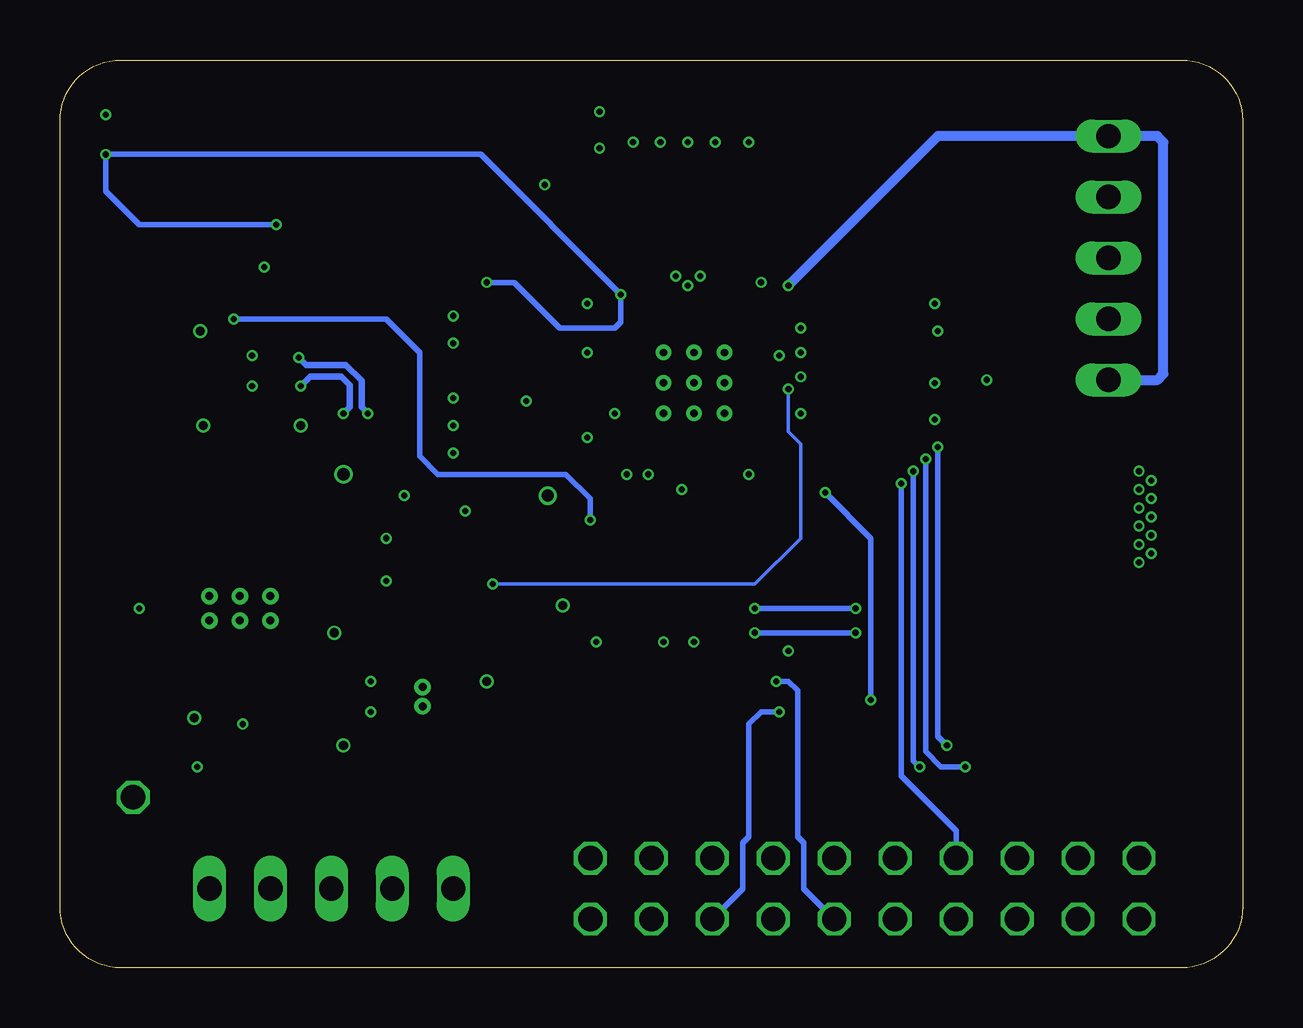
[diagram p7: board, bottom side, seen from below]

Size 49.28 x 37.85 mm. Coordinates in mm from the lower left corner, seen from the top.
Outline: 0,35.31 0,2.54 arc90 2.54,0 46.74,0 arc90 49.28,2.54 49.28,35.31 arc90 46.74,37.85 2.54,37.85 arc90 0,35.31
Copper layers (1+2*15+16): Top 0.035559375mm / dielectric 0.17018125mm / Route2 0.01778125mm / dielectric 47mil / Route15 0.01778125mm / dielectric 0.17018125mm / Bottom 0.035559375mm
Design rules "OSHPark-4Layer": minimum track width 5mil, minimum drill 10mil, track to track 5mil, track to pad 5mil, pad to pad 5mil, via to via 5mil, smd to smd 5mil, copper to edge 15mil, drill to drill 5mil, minimum pad ring 7mil, minimum via ring 4mil, stop-mask expansion 3mil, vias tented up to drill 11mil, thermal gap 10mil

### Footprints (pad centres in the part's own frame; a part is rotated, then mirrored left to right if it is on the bottom)
C0402 = smd 0.59 x 0.64: 1 -0.48,0; 2 0.48,0
C0603 = smd 0.95 x 1: 1 -0.8,0; 2 0.8,0
DIALIGHT-0603 = smd 0.8 x 0.8: 1 -0.8,0; 2 0.8,0
DX4R005H91R1500 = smd 0.4 x 1.35: P$1 -1.3,4.125; P$2 -0.65,4.125; P$3 0,4.125; P$4 0.65,4.125; P$5 1.3,4.125
1X05 = drill 1.016 long: 1 -5.08,0; 2 -2.54,0; 3 0,0; 4 2.54,0; 5 5.08,0
IPEX-MHF = smd 2.2 x 1.05: P$1 0,1.475; P$2 0,-1.475 | smd 1.05 x 1: P$3 1.525,0
2X10 = drill 1.016 octagon: 1 -11.43,-1.27; 2 -11.43,1.27; 3 -8.89,-1.27; 4 -8.89,1.27; 5 -6.35,-1.27; 6 -6.35,1.27; 7 -3.81,-1.27; 8 -3.81,1.27; 9 -1.27,-1.27; 10 -1.27,1.27; 11 1.27,-1.27; 12 1.27,1.27; 13 3.81,-1.27; 14 3.81,1.27; 15 6.35,-1.27; 16 6.35,1.27; 17 8.89,-1.27; 18 8.89,1.27; 19 11.43,-1.27; 20 11.43,1.27
R0402 = smd 0.59 x 0.64: 1 -0.48,0; 2 0.48,0
TESTPOINT-1.5 = smd 1.5 x 1.5: P$1 0,0
1X01 = drill 1.016 octagon: 1 0,0
SOT323-6L = smd 0.35 x 1: P$1 -0.65,-0.95; P$2 0,-0.95; P$3 0.65,-0.95; P$4 0.65,0.95; P$5 0,0.95; P$6 -0.65,0.95
TQFP-64-EXPOSED-PAD = smd 0.28 x 1.6: P$1 -3.75,-5.68; P$2 -3.25,-5.68; P$3 -2.75,-5.68; P$4 -2.25,-5.68; P$5 -1.75,-5.68; P$6 -1.25,-5.68; P$7 -0.75,-5.68; P$8 -0.25,-5.68; P$9 0.25,-5.68; P$10 0.75,-5.68; P$11 1.25,-5.68; P$12 1.75,-5.68; P$13 2.25,-5.68; P$14 2.75,-5.68; P$15 3.25,-5.68; P$16 3.75,-5.68; P$33 3.75,5.68; P$34 3.25,5.68; P$35 2.75,5.68; P$36 2.25,5.68; P$37 1.75,5.68; P$38 1.25,5.68; P$39 0.75,5.68; P$40 0.25,5.68; P$41 -0.25,5.68; P$42 -0.75,5.68; P$43 -1.25,5.68; P$44 -1.75,5.68; P$45 -2.25,5.68; P$46 -2.75,5.68; P$47 -3.25,5.68; P$48 -3.75,5.68 | smd 1.6 x 0.28: P$17 5.68,-3.75; P$18 5.68,-3.25; P$19 5.68,-2.75; P$20 5.68,-2.25; P$21 5.68,-1.75; P$22 5.68,-1.25; P$23 5.68,-0.75; P$24 5.68,-0.25; P$25 5.68,0.25; P$26 5.68,0.75; P$27 5.68,1.25; P$28 5.68,1.75; P$29 5.68,2.25; P$30 5.68,2.75; P$31 5.68,3.25; P$32 5.68,3.75; P$49 -5.68,3.75; P$50 -5.68,3.25; P$51 -5.68,2.75; P$52 -5.68,2.25; P$53 -5.68,1.75; P$54 -5.68,1.25; P$55 -5.68,0.75; P$56 -5.68,0.25; P$57 -5.68,-0.25; P$58 -5.68,-0.75; P$59 -5.68,-1.25; P$60 -5.68,-1.75; P$61 -5.68,-2.25; P$62 -5.68,-2.75; P$63 -5.68,-3.25; P$64 -5.68,-3.75 | smd 5.31 x 5.31: P$65 0,0 | drill 0.3 pad 0.6: P$66 -1.27,1.27; P$67 0,1.27; P$68 1.27,1.27; P$69 -1.27,0; P$70 0,0; P$71 1.27,0; P$72 -1.27,-1.27; P$73 0,-1.27; P$74 1.27,-1.27
P-PWSON-N6 = smd 0.3 x 0.7: P$1 -0.65,-1.05; P$2 0,-1.05; P$3 0.65,-1.05; P$4 0.65,1.05; P$5 0,1.05; P$6 -0.65,1.05 | drill 0.33 pad 0.5: P$8 -0.4,0; P$9 0.4,0 | smd 1.6 x 1: P$EP 0,0
PSOP-8-POWERPAD-DDA = smd 0.6 x 1.6: 1 -1.905,-2.7; 2 -0.635,-2.7; 3 0.635,-2.7; 4 1.905,-2.7; 5 1.905,2.7; 6 0.635,2.7; 7 -0.635,2.7; 8 -1.905,2.7 | smd 4.95 x 2: EP 0,0 | drill 0.33: P$1 0,0.508; P$2 -1.27,0.508; P$3 -1.27,-0.508; P$4 0,-0.508; P$5 1.27,-0.508; P$6 1.27,0.508
R-PDSO-G6 = smd 0.6 x 1.1: 1 -0.95,-1.35; 2 0,-1.35; 3 0.95,-1.35; 4 0.95,1.35; 5 0,1.35; 6 -0.95,1.35
R-PDSO-N5 = smd 0.3 x 0.45: 1 -0.5,-0.675; 2 0,-0.675; 3 0.5,-0.675; 4 0.5,0.675; 5 -0.5,0.675
KC2520C = smd 1.27 x 0.635: P$1 -0.925,-0.725; P$2 0.925,-0.725; P$3 0.925,0.725; P$4 -0.925,0.725

### Placement (x,y rotation side)
C1  8.38,25.4 90 top
C2  37.47,11.3 90 top
C3  35.81,13.97 0 top
C4  45.97,12.83 270 top
C5  45.97,17.27 270 top
C6  40.39,10.16 180 top
C7  31.62,21.46 0 top
C8  13.46,26.04 90 top
C9  32.38,17.78 270 top
C10  26.92,14.86 270 top
C11  36.2,19.68 0 top
C12  18.92,14.48 270 top
C13  20.57,33.15 90 top
C14  22.86,14.86 270 top
C15  24.26,33.15 90 top
C16  14.1,22.86 180 top
C17  14.1,27.69 180 top
C18  31.62,26.04 0 top
C19  31.62,27.18 0 top
C20  24.13,14.86 270 top
C21  21.97,33.15 90 top
C22  14.1,24.38 180 top
C23  23.11,33.15 90 top
C24  41.27,22.61 180 top
C28  25.4,33.15 90 top
C30  31.62,22.61 0 top
D1  45.21,35.56 180 top
D2  45.21,33.91 180 top
D3  45.21,32.26 180 top
J1  48.9,25.27 90 top
J2  37.97,3.3 180 top
J3  6.6,18.8 0 top
J4  15.75,3.3 180 top
J5  5.59,29.59 90 top
R1  31.62,23.75 180 top
R2  20.7,10.67 180 top
R3  20.7,11.94 180 top
R4  31.5,10.67 90 top
R5  32.38,15.62 270 top
R6  14.61,26.04 90 top
R7  25.4,14.86 270 top
R8  30.86,35.69 0 top
R9  30.86,34.16 0 top
R10  30.86,32.64 0 top
TP1  43.56,7.11 0 top
TP2  31.5,30.1 0 top
TP3  14.1,11.18 0 top
TP4  46.23,7.11 90 top
TP5  29.84,7.87 0 top
TP6  10.67,22.23 0 top
U1  41.27,24.89 270 top
U2  22.86,24.38 0 top
U3  34.16,11.3 270 top
U4  41.78,14.99 0 top
U5  35.69,17.02 90 top
U6  40.77,29.21 0 top
X1  10.67,25.4 270 top

### Tracks (layer width: path | path; a pad name or v marks a point on that pad's centre or on a via)
3V3_PG
  Top 0.152: U4.8 39.02,17.69 38.73,17.4 38.73,9.27 38.1,8.64 32.13,8.64 31.5,9.27 R4.1 32.03,10.19 32.5,10.65 U3.P$3
  Top 0.229: TP5.P$1 29.84,9.4 30.64,10.19 R4.1
!RESET  (via drill 0.25)
  Top 0.152: U5.1 36.39,16.07 35.94,15.62 35.43,15.62 34.99,16.07 U5.6 32.42,16.07 R5.1 32.29,16 v31.24,16
  Top 0.229: U2.P$57 v18.92,24.13 18.92,20.45 17.02,18.54 17.02,14.86 16.64,14.48 12.7,14.48 9.4,11.18 J4.15
  Bottom 0.152: v18.92,24.13 18.92,22.35 18.41,21.84 18.41,17.91 20.32,16 v31.24,16
+1V0  (via drill 0.25, 0.51)
  Top 0.229: 43.05,17.65 42.45,17.65 U4.6 | C14.1 22.86,15.88 23.11,16.12 U2.P$9 23.11,19.68 v23.37,19.94 23.61,19.7 U2.P$10 23.61,16.39 24.13,15.88 C20.1 | v27.3,22.1 27.34,22.13 U2.P$20 29.94,22.13 30.61,21.46 C7.1 | v27.3,25.65 27.32,25.63 U2.P$27 29.95,25.63 30.35,26.04 C18.1 | v27.3,27.69 27.36,27.63 U2.P$31 29.77,27.63 30.23,27.18 C19.1 | v18.41,24.64 v18.41,24.63 U2.P$56 15.62,24.64 15.37,24.38 C22.1 | v23.11,28.45 U2.P$40 C23.1 | U2.P$52 16.16,26.63 15.11,27.69 C17.1 14.61,27.66 R6.2 | U2.P$59 15.39,23.13 15.11,22.86 C16.1 | C21.1 21.97,31.88 22.61,31.24 U2.P$41 | C15.1 24.26,31.88 23.62,31.24 23.62,30.08 U2.P$39 | TP3.P$1 v15.49,11.18
  Top 0.254: U2.P$39 23.61,28.84 v23.62,28.83 | U2.P$41 v22.61,28.83 | U2.P$52 18.38,26.63 v18.41,26.67 | U2.P$59 18.39,23.13 v18.41,23.11 | v37.47,20.57 37.47,19.94 37.21,19.68 C11.2 36.7,19.66 36.7,18.92 37.04,18.59 U5.3
  Top 0.406: 45.85,17.95 C5.1 45.94,18.03 44.83,18.03 44.48,17.69 U4.5
  Top 0.508: U4.5 43.09,17.69 43.05,17.65 43.05,19.68 42.16,20.57 v37.47,20.57 30.61,20.57 29.72,19.68 v28.96,19.68
  Bottom 0.229: v15.49,11.18 15.49,17.91 v17.4,19.81
  pour Route15 (rank 4): 19.05,31.5 15.88,28.32 15.88,20.45 18.92,17.4 28.07,17.4 29.84,19.18 29.84,22.48 29.21,23.11 29.21,24.13 29.84,24.77 29.84,28.32 26.67,31.5
  pour Top (no thermals): 42.16,16.89 42.16,18.41 42.93,19.18 43.18,19.18 43.94,18.41 43.94,16.89
+3V3  (via drill 0.25, 0.38)
  Top 0.229: R7.2 25.94,14.38 26.16,14.61 26.16,15.11 26.39,15.34 C10.1 26.92,16.89 26.42,17.4 25.4,17.4 25.11,17.69 U2.P$13 25.11,20.23 v24.77,20.57 | C30.1 30.61,22.61 30.08,23.13 U2.P$22 26.18,23.13 v26.16,23.11 | C28.1 25.4,31.88 26.11,31.17 U2.P$34 26.11,28.27 v25.91,28.07 | C13.1 20.57,32 21.11,31.47 U2.P$44 21.11,28.86 20.83,28.57 v20.07,28.57 | C1.2 8.83,26.32 X1.P$1 X1.P$4 11.39,29.05 12.19,29.84 17.53,29.84 v18.92,28.45 | U2.P$55 18.91,25.13 v19.3,25.53 | U2.P$3 20.11,20.11 v20.57,20.57 | R4.2 v31.5,11.94 31.5,11.95 | R5.2 28.35,15.14 v28.32,15.11 | D2.1 v47.37,33.91 | U6.5 v40.27,30.98 v40.26,30.99 | TP2.P$1 v31.5,28.57
  Top 0.254: U2.P$3 20.11,17.06 18.92,15.88 C12.1
  Top 0.406: U3.P$1 31.5,11.95 30.59,11.95 28.32,14.22 v28.32,15.11 28.32,18.8 26.54,20.57 v25.65,20.57 | C3.1 32.26,13.97 31.5,13.21 v31.5,11.94
  Bottom 0.229: v40.26,30.99 45.97,30.99 47.37,32.38 v47.37,33.91 31.75,33.91 v25.91,28.07 25.91,26.92 26.16,26.67 28.45,26.67 30.35,28.57 v31.5,28.57
  Bottom 0.406: v18.92,28.45 12.7,34.67 J5.5 3.56,34.67 3.3,34.42 3.3,24.77 3.56,24.51 J5.1
  pour Route15: 20.45,20.83 20.32,20.7 20.32,20.45 20.45,20.32 20.83,20.32 20.95,20.45 24.38,20.45 24.77,20.07 25.78,20.07 26.42,20.7 26.42,28.19 26.16,28.45 25.65,28.45 25.15,27.94 22.1,27.94 21.21,28.83 20.45,28.83 20.32,28.96 19.81,28.96 19.68,28.83 18.92,28.83 18.67,28.57 18.67,28.19 19.18,27.69 19.18,25.91 19.05,25.78 19.05,25.4 19.18,25.27 19.43,25.27 19.56,25.4 19.56,25.78 19.43,25.91 19.43,27.94 19.81,28.32 20.32,28.32 20.45,28.45 21.08,28.45 21.97,27.56 25.78,27.56 26.04,27.3 26.04,23.62 25.78,23.37 25.78,22.86 26.04,22.61 26.04,21.34 25.78,21.08 24.77,21.08 24.38,20.7 20.95,20.7 20.83,20.83
+5V  (via drill 0.25, 0.38)
  Top 0.229: C9.2 32.41,17.27 33.15,17.27 33.4,17.02 U5.5 U5.4 | U2.P$23 29.83,23.63 v29.84,23.62 | D1.1 v47.37,35.56 | TP1.P$1 v43.56,8.38
  Top 0.305: U3.P$4 36.31,10.65 v36.32,10.67 | U3.P$6 36.31,11.95 v36.32,11.94 | U5.5 35.31,17.02 35.69,17.4 v35.69,17.91 35.63,17.97
  Top 0.356: U1.P$5 41.66,24.89 41.27,25.27 v41.27,25.53
  Top 0.406: C24.1 v43.31,22.61 43.31,23.62 43.66,23.97 J1.P$1 | U4.4 45.72,12.29 C4.2 | v36.32,11.94 37.3,11.94 C2.2
  Top 0.559: U4.4 v43.69,10.41
  pour Route15 (rank 6): 49.28,35.31 49.28,2.54 arc-90 46.74,0 2.54,0 arc-90 0,2.54 0,35.31 arc-90 2.54,37.85 46.74,37.85 arc-90
AGND  (via drill 0.25, 0.38)
  Top 0.229: C14.2 v22.86,13.59 | C20.2 v24.13,13.59 | C10.2 v26.92,13.59 | R1.1 v32.89,23.75 | C19.2 v32.89,27.18 | C18.2 v32.89,26.04 | C30.2 v32.89,22.61 | C7.2 v32.89,21.46 | U2.P$54 18.39,25.63 v18.41,25.65 | C8.2 12.73,26.52 v12.7,26.54 | C22.2 v12.83,24.38 | C16.2 v12.83,22.86 | C13.2 v20.57,34.42 | C21.2 v21.97,34.42 | C23.2 v23.11,34.42 | C15.2 v24.26,34.42 | C28.2 v25.4,34.42 | C17.2 v12.83,27.69 | C12.2 v18.92,13.21 | C1.1 8.83,24.48 X1.P$2 10.63,24.48 v10.67,24.51 | 34.56,11.3 U3.P$EP | U4.P$4 U4.EP | C9.1 v32.38,19.05 | R10.1 v29.08,32.64 | R9.1 v26.8,34.16 | R8.1 v26.8,35.69 | U6.3 41.27,28.96 41.02,29.21 v40.77,29.21
  Top 0.254: C11.1 v34.92,19.68
  Top 0.305: U5.2 36.07,17.02 35.69,16.64 v35.69,16.13 | C6.1 v41.66,10.16 | U3.P$5 34.56,11.3 U3.P$8
  Top 0.356: U1.P$2 40.89,24.89 41.27,24.51 v41.27,24.26
  Top 0.406: C24.2 v39.24,22.61 | C4.1 v45.97,14.99 C5.2 | U4.3 42.42,12.95 41.91,13.46 41.91,14.35 U4.P$4 | C3.2 v37.85,13.97 | C2.1 v37.47,9.27 | J1.P$5 43.46,26.57 v43.43,26.54
  other vias: 3.81,20.32 4.32,20.7 4.32,19.94 4.32,19.18 3.81,19.56 3.81,18.8 4.32,18.41 3.81,18.03 4.32,17.65 3.81,17.27 4.32,16.89
  pour Route2: 49.28,35.31 49.28,2.54 arc-90 46.74,0 2.54,0 arc-90 0,2.54 0,35.31 arc-90 2.54,37.85 46.74,37.85 arc-90
  pour Top: 3.56,20.57 3.56,17.02 4.32,16.26 8.13,16.26 9.91,18.03 14.73,18.03 16.76,20.07 16.76,20.32 14.61,20.32 13.97,19.68 9.78,19.68 8.13,21.34 4.32,21.34
AUDIO_STATUS  (via drill 0.25)
  Top 0.229: U2.P$16 27.14,18.7 v27.18,18.67 | v42.04,27.05 41.27,27.05 40.77,27.56 U6.2 U6.1
  Bottom 0.229: v27.18,18.67 27.18,19.56 28.19,20.57 33.53,20.57 34.29,21.34 34.29,25.65 35.69,27.05 v42.04,27.05
CLEAN_USB_D_N  (via drill 0.25)
  Top 0.279: U2.P$26 36.67,25.13 37.2,24.61 37.2,23.38 v37.47,23.11 | v39.24,24.26 40.31,24.26 U1.P$3
  Bottom 0.279: v37.47,23.11 37.21,23.37 37.21,24.3 37.56,24.65 38.85,24.65 v39.24,24.26
CLEAN_USB_D_P  (via drill 0.25)
  Top 0.279: U2.P$25 36.49,24.63 36.72,24.41 36.72,23.38 v36.45,23.11 | v39.33,25.44 40.23,25.44 U1.P$1
  Bottom 0.279: v36.45,23.11 36.7,23.37 36.7,24.47 37.37,25.13 39.02,25.13 v39.33,25.44
CLK
  Top 0.229: U2.P$58 11.93,23.63 11.56,24 11.56,24.31 X1.P$3 11.44,24.43 11.44,24.27 10.67,23.5 TP6.P$1
I2S_BCLK
  Top 0.229: 18.03,9.4 18.03,8.13 19.05,7.11 27.81,7.11 28.7,6.22 30.86,6.22 31.75,7.11 36.07,7.11 37.97,5.21 J2.3
  Top 0.254: U2.P$2 19.61,17.2 18.8,16.38 18.41,16.38 18.03,16 18.03,9.4
I2S_DATA
  Top 0.229: 18.54,9.4 18.54,8.38 19.3,7.62 28.07,7.62 28.96,6.73 30.61,6.73 31.5,7.62 38.1,7.62 40.51,5.21 J2.2
  Top 0.254: U2.P$4 20.61,16.8 19.81,16 19.81,13.08 18.54,11.81 18.54,9.4
I2S_LRCLK
  Top 0.229: 17.53,9.4 17.53,7.87 18.8,6.6 27.56,6.6 28.45,5.71 31.11,5.71 32,6.6 34.16,6.6 35.43,5.33 J2.4
  Top 0.254: U2.P$1 19.11,17.33 18.67,16.89 18.16,16.89 17.53,16.26 17.53,9.4
I2S_MCLK
  Top 0.229: U2.P$64 16.19,20.63 14.39,18.84 8.17,18.84 J3.P$3
LINK_DOWN0  (via drill 0.25)
  Top 0.229: U2.P$6 21.61,16.53 20.83,15.75 20.83,14.48 v20.32,13.97 | v16.13,13.97 12.95,13.97 10.67,11.68 10.67,3.3 J4.14
  Bottom 0.229: v20.32,13.97 v16.13,13.97
LINK_DOWN1  (via drill 0.25)
  Top 0.229: U2.P$5 21.11,16.66 20.32,15.88 v20.32,14.99 | v16.13,14.99 12.45,14.99 5.59,8.13 5.59,3.3 J4.18
  Bottom 0.229: 20.32,14.86 v20.32,14.99 v16.13,14.99
LINK_UP0  (via drill 0.25)
  Top 0.229: v19.43,11.94 R3.2
  Bottom 0.229: v19.43,11.94 18.92,11.94 18.54,11.56 18.54,5.46 18.29,5.21 18.29,3.3 J4.10
LINK_UP1  (via drill 0.25)
  Top 0.229: R2.2 v19.3,10.67
  Bottom 0.229: v19.3,10.67 20.07,10.67 20.57,10.16 20.57,5.46 20.83,5.21 20.83,3.3 J4.6
MCLK_SEL
  Top 0.229: U2.P$42 22.11,31.1 21.34,31.88 21.34,34.67 20.7,35.31 13.08,35.31 7.37,29.59 J5.3
N$1
  Top 0.229: U2.P$24 30.09,24.13 30.48,23.75 R1.2
N$2  (via drill 0.25)
  Top 0.229: U2.P$60 15.65,22.63 14.73,21.72 v12.7,21.72 | v12.32,9.27 12.32,7.49 12.95,6.86 17.02,6.86 19.3,4.57 J4.7
  Bottom 0.229: v12.7,21.72 12.7,9.65 v12.32,9.27
N$3  (via drill 0.25)
  Top 0.229: U2.P$61 15.78,22.13 14.86,21.21 v13.21,21.21 | v11.56,8.38 11.56,6.99 12.32,6.22 15.37,6.22 J4.9
  Bottom 0.229: v13.21,21.21 13.21,9.02 12.57,8.38 v11.56,8.38
N$4  (via drill 0.25)
  Top 0.229: U2.P$62 15.92,21.63 14.99,20.7 v13.72,20.7 | v13.46,8.38 16.26,8.38 18.54,6.1 20.57,6.1 J4.5
  Bottom 0.229: v13.72,20.7 13.72,8.64 v13.46,8.38
N$5  (via drill 0.25)
  Top 0.229: U2.P$63 16.05,21.13 15.11,20.19 v14.22,20.19
  Bottom 0.229: v14.22,20.19 14.22,8 11.94,5.71 J4.13
N$6
  Top 0.229: C8.1 R6.1 15.52,25.55 16.1,26.13 U2.P$53
N$7
  Top 0.229: R8.2 44.28,35.69 D1.2
N$8
  Top 0.229: 22.1,18.69 U2.P$7 22.11,16.39 21.34,15.62 21.34,12.06 21.21,11.94 R3.1
N$9
  Top 0.229: U2.P$8 22.61,16.26 21.84,15.49 21.84,12.7 22.23,12.32 22.23,11.05 21.84,10.67 R2.1
N$10
  Top 0.229: U2.P$11 24.11,16.63 R7.1
N$11
  Top 0.229: C6.2 39.91,12.26 U4.1
N$12
  Top 0.229: R9.2 44.16,34.16 D2.2
N$13
  Top 0.229: U6.4 44.62,29.89 46.01,31.28 D3.1
N$14
  Top 0.229: R10.2 44.03,32.64 D3.2
RAW_USB_D_N
  Top 0.279: J1.P$2 43.42,24.62 43.05,24.26 42.24,24.26 U1.P$4
RAW_USB_D_P
  Top 0.279: J1.P$3 43.31,25.27 43.05,25.53 42.24,25.53 U1.P$6

### Text on the board
tNames: +5V | +3V3 | AUDIO_STS | SmartStand USB DAC/I2S (rev A)